# EAGLE design uhf container (EAGLE 9.0.1)
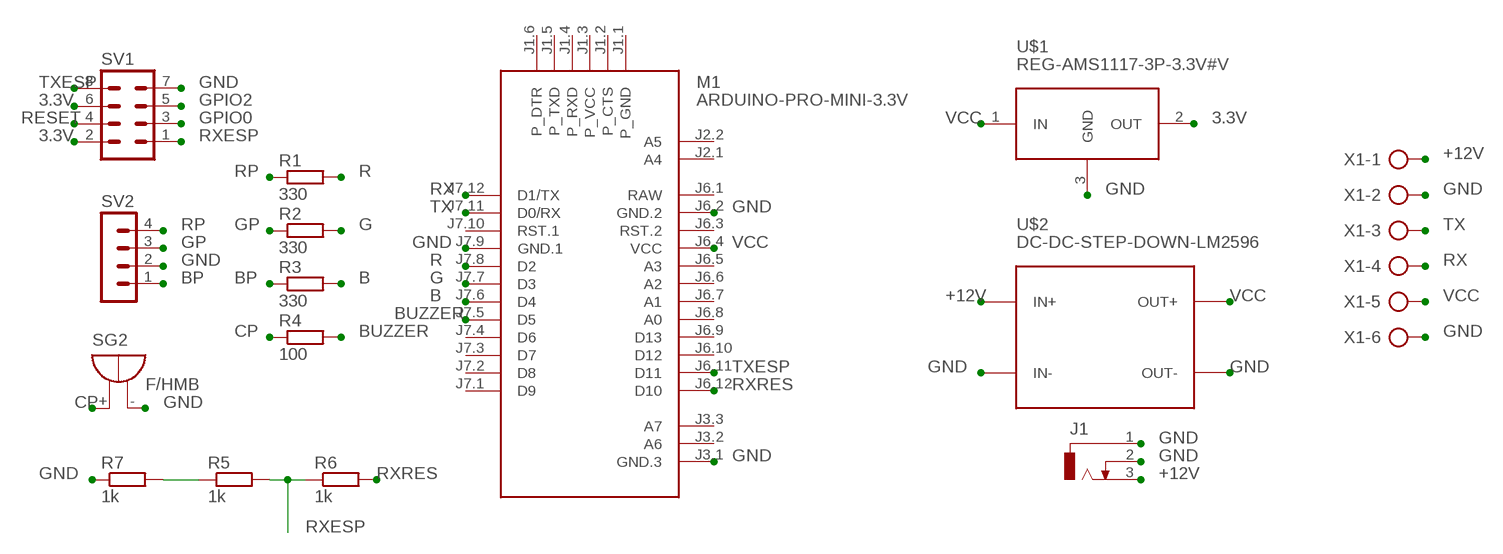
[diagram p0: schematic, sheet 1]

## Parts
J1  DCJ0303  [DCJ0303]
M1  ARDUINO-PRO-MINI-3.3V  [ARDUINO-PRO-MINI]
R1  330  R-EU_0207/7  [0207/7]
R2  330  R-EU_0207/7  [0207/7]
R3  330  R-EU_0207/7  [0207/7]
R4  100  R-EU_0207/7  [0207/7]
R5  1k  R-EU_0207/7  [0207/7]
R6  1k  R-EU_0207/7  [0207/7]
R7  1k  R-EU_0207/7  [0207/7]
SG2  F/HMB  [F/HMB]
SV1  MA04-2  [MA04-2]
SV2  MA04-1  [MA04-1]
U$1  REG-AMS1117-3P-3.3V#V  [REG-AMS1117-3P#V]
U$2  DC-DC-STEP-DOWN-LM2596  [DC-DC-STEP-DOWN-LM2596]
X1  AK300/6  [AK300/6]

## Nets
3.3V: SV1.2 SV1.6 U$1.2(OUT)
+12V: J1.3 U$2.IN+ X1.1
B: M1.J7.6(D4) R3.2
BP: R3.1 SV2.1
BUZZER: M1.J7.5(D5) R4.2
CP: R4.1 SG2.+
G: M1.J7.7(D3) R2.2
GND: J1.1 J1.2 M1.J3.1(GND.3) M1.J6.2(GND.2) M1.J7.9(GND.1) R7.1 SG2.- SV1.7 SV2.2 U$1.3(GND) U$2.IN- U$2.OUT- X1.2 X1.6
GP: R2.1 SV2.3
GPIO0: SV1.3
GPIO2: SV1.5
N$1: R5.1 R7.2
R: M1.J7.8(D2) R1.2
RESET: SV1.4
RP: R1.1 SV2.4
RX: M1.J7.12(D1/TX) X1.4
RXESP: R5.2 R6.1 SV1.1
RXRES: M1.J6.12(D10) R6.2
TX: M1.J7.11(D0/RX) X1.3
TXESP: M1.J6.11(D11) SV1.8
VCC: M1.J6.4(VCC) U$1.1(IN) U$2.OUT+ X1.5
Unconnected: M1.J1.1(P_GND) M1.J1.2(P_CTS) M1.J1.3(P_VCC) M1.J1.4(P_RXD) M1.J1.5(P_TXD) M1.J1.6(P_DTR) M1.J2.1(A4) M1.J2.2(A5) M1.J3.2(A6) M1.J3.3(A7) M1.J6.3(RST.2) M1.J6.5(A3) M1.J6.6(A2) M1.J6.7(A1) M1.J6.8(A0) M1.J6.9(D13) M1.J6.10(D12) M1.J7.1(D9) M1.J7.2(D8) M1.J7.3(D7) M1.J7.4(D6) M1.J7.10(RST.1)

## Power pins joined to a net without a drawn wire
RAW: M1.J6.1(RAW)

## Library data of the parts
J1 = con-jack:DCJ0303: DC POWER JACK Source: DCJ0303.pdf; OC_FARNELL: unknown; OC_NEWARK: unknown
M1 = diy-modules:ARDUINO-PRO-MINI-*: Arduino Pro Mini and compatible devices More details available here: https://www.arduino.cc/en/Main/ArduinoBoardProMini Click here to find device on ebay.com <http://www.ebay.com/sch/arduino+pro+mini>
R1-R7 = resistor:R-EU_: RESISTOR, European symbol
SG2 = buzzer:F/HMB: BUZZER Source: Buerklin; OC_FARNELL: unknown; OC_NEWARK: unknown
SV1 = con-lstb:MA04-2: PIN HEADER; OC_FARNELL: unknown; OC_NEWARK: unknown
SV2 = con-lstb:MA04-1: PIN HEADER; OC_FARNELL: unknown; OC_NEWARK: unknown
U$1 = diy-modules:REG-AMS1117-3P-*: Linear Regulator based on AMS1117 chip 3-pin version AMS1117 datasheet is available here: http://www.advanced-monolithic.com/pdf/ds1117.pdf Click here to find device on ebay.com <http://www.ebay.com/sch/ams1117+module> Note: There are many variants. Search for the proper version.
U$2 = diy-modules:DC-DC-STEP-DOWN-LM2596: DC/DC Step-Down Regulator based on LM2596-ADJ chip LM2596 datasheet available here: http://www.ti.com/lit/ds/symlink/lm2596.pdf Click here to find device on ebay.com <http://www.ebay.com/sch/lm2596+power+regulator>
X1 = con-ptr500:AK300/6: CONNECTOR; OC_FARNELL: unknown; OC_NEWARK: unknown

## Board
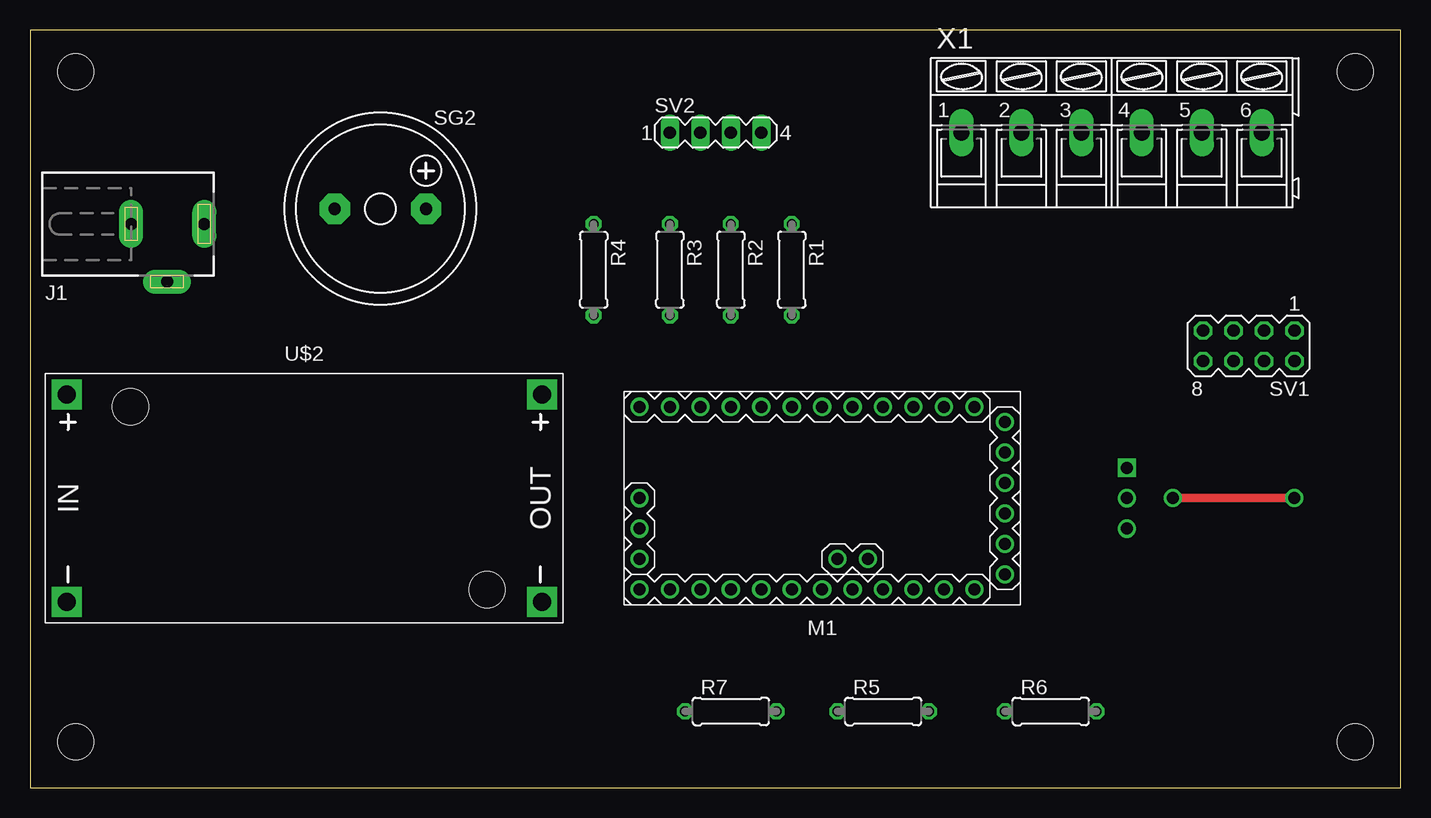
[diagram p1: board, top side]
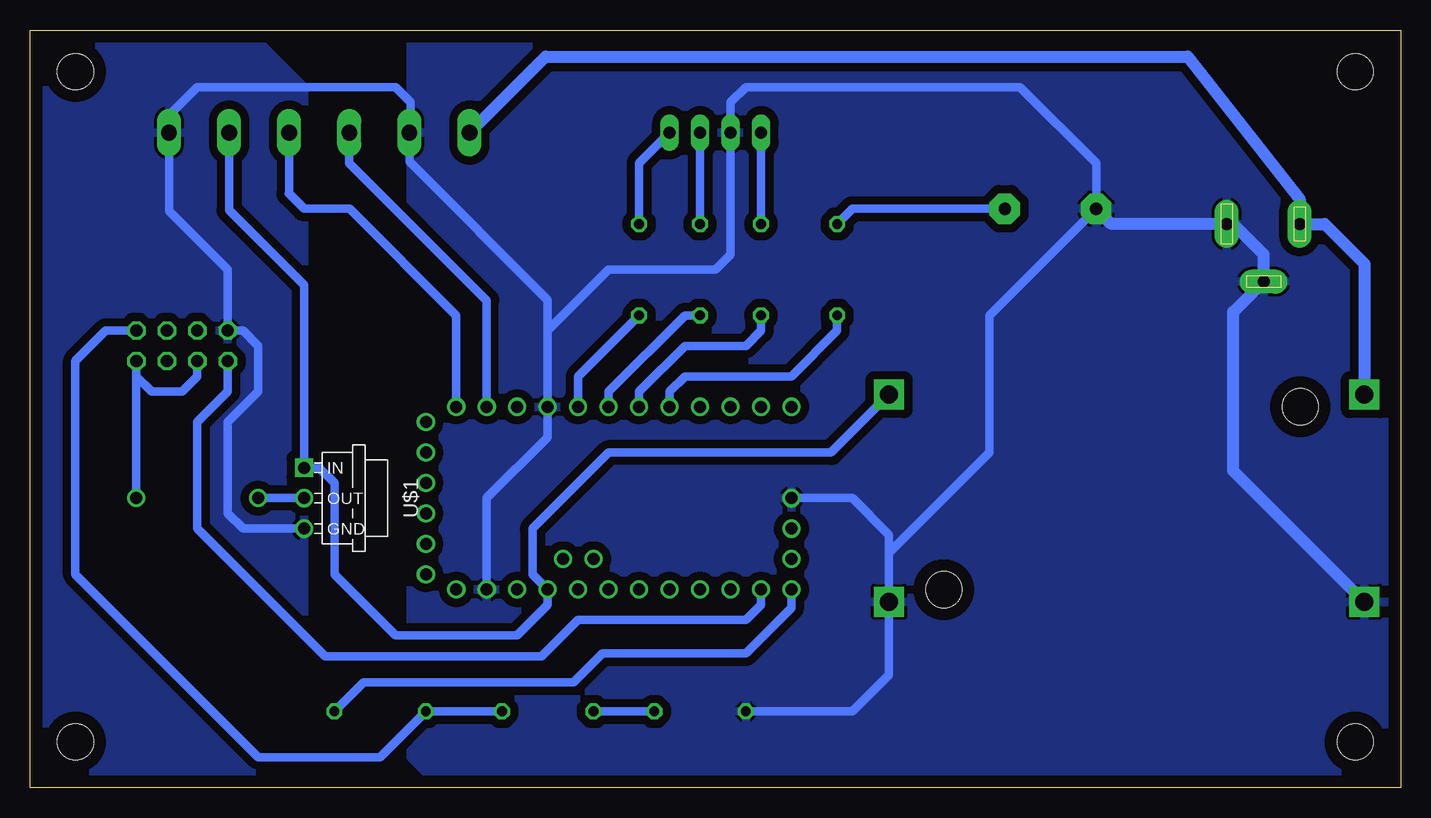
[diagram p2: board, bottom side, seen from below]

Size 114.28 x 63.17 mm. Coordinates in mm from the lower left corner, seen from the top.
Outline: 0,0 114.28,0 114.28,63.17 0,63.17 0,0
Copper layers (1*16): Top 0.035mm / dielectric 1.5mm / Bottom 0.035mm
Design rules "default *": minimum track width 6mil, minimum drill 0.35mm, track to track 0.7mm, track to pad 0.7mm, pad to pad 0.7mm, via to via 0.7mm, smd to smd 0.7mm, copper to edge 40mil, drill to drill 6mil, minimum pad ring 10mil, minimum via ring 8mil, stop-mask expansion 4mil, vias tented up to drill 0mil, thermal gap 10mil
Holes 3 mm at 3.81,59.69 3.81,3.81 110.49,3.81 110.49,59.69

### Footprints (pad centres in the part's own frame; a part is rotated, then mirrored left to right if it is on the bottom)
DCJ0303 = drill 1 pad 2 long: 1 0,3.1; 2 4.8,0; 3 0,-3
ARDUINO-PRO-MINI = drill 1: J1.1 -15.24,6.35; J1.2 -15.24,3.81; J1.3 -15.24,1.27; J1.4 -15.24,-1.27; J1.5 -15.24,-3.81; J1.6 -15.24,-6.35; J2.1 -1.27,5.08; J2.2 -3.81,5.08; J3.1 15.24,0; J3.2 15.24,2.54; J3.3 15.24,5.08; J6.1 -12.7,7.62; J6.2 -10.16,7.62; J6.3 -7.62,7.62; J6.4 -5.08,7.62; J6.5 -2.54,7.62; J6.6 0,7.62; J6.7 2.54,7.62; J6.8 5.08,7.62; J6.9 7.62,7.62; J6.10 10.16,7.62; J6.11 12.7,7.62; J6.12 15.24,7.62; J7.1 15.24,-7.62; J7.2 12.7,-7.62; J7.3 10.16,-7.62; J7.4 7.62,-7.62; J7.5 5.08,-7.62; J7.6 2.54,-7.62; J7.7 0,-7.62; J7.8 -2.54,-7.62; J7.9 -5.08,-7.62; J7.10 -7.62,-7.62; J7.11 -10.16,-7.62; J7.12 -12.7,-7.62
0207/7 = drill 0.813 octagon: 1 -3.81,0; 2 3.81,0
F/HMB = drill 1.016 pad 2.54 octagon: + 3.81,0; - -3.81,0
MA04-2 = drill 1.016 octagon: 1 -3.81,-1.27; 2 -3.81,1.27; 3 -1.27,-1.27; 4 -1.27,1.27; 5 1.27,-1.27; 6 1.27,1.27; 7 3.81,-1.27; 8 3.81,1.27
MA04-1 = drill 1.016 long: 1 -3.81,0; 2 -1.27,0; 3 1.27,0; 4 3.81,0
REG-AMS1117-3P#V = drill 1 square: 1 -2.54,-5.08 | drill 1: 2 0,-5.08; 3 2.54,-5.08
DC-DC-STEP-DOWN-LM2596 = drill 1.5 pad 2.5 square: IN+ -19.812,8.636; IN- -19.812,-8.636; OUT+ 19.812,8.636; OUT- 19.812,-8.636 | hole 3: -14.478,7.62; 15.24,-7.62
AK300/6 = drill 1.321 long: 1 -12.522,0; 2 -7.518,0; 3 -2.515,0; 4 2.515,0; 5 7.518,0; 6 12.522,0

### Placement (x,y rotation side)
J1  11.43,46.99 270 top
M1  66.04,24.13 180 top
R1  63.5,43.18 270 top
R2  58.42,43.18 270 top
R3  53.34,43.18 270 top
R4  46.99,43.18 270 top
R5  71.12,6.35 0 top
R6  85.09,6.35 0 top
R7  58.42,6.35 0 top
SG2  29.21,48.26 0 top
SV1  101.6,36.83 180 top
SV2  57.15,54.61 0 top
U$1  86.36,24.13 270 bottom
U$2  22.86,24.13 0 top
X1  90.17,54.61 0 top

### Tracks (layer width: path | path; a pad name or v marks a point on that pad's centre or on a via)
3.3V  (via drill 1)
  Top 0.7: v95.25,24.13 v105.41,24.13
  Bottom 0.7: SV1.6 100.33,34.29 101.6,33.02 104.14,33.02 105.41,34.29 SV1.2 v105.41,24.13 | U$1.2 v95.25,24.13
+12V
  Bottom 1: U$2.IN+ 3.05,43.69 6.35,46.99 J1.3 8.43,49.07 17.78,60.96 71.3,60.96 X1.1
B
  Bottom 0.7: M1.J7.6 63.5,33.02 59.69,36.83 54.61,36.83 53.34,38.1 R3.2
BP
  Bottom 0.7: SV2.1 R3.1
BUZZER
  Bottom 0.7: M1.J7.5 60.96,33.02 59.69,34.29 50.8,34.29 46.99,38.1 R4.2
CP
  Bottom 0.7: R4.1 45.72,48.26 SG2.+
G
  Bottom 0.7: M1.J7.7 66.04,33.02 59.69,39.37 R2.2
GND
  Bottom 0.7: 71.12,38.1 66.04,43.18 57.15,43.18 55.88,44.45 SV2.2 55.88,57.15 54.61,58.42 31.75,58.42 25.4,52.07 SG2.- 34.29,39.37 34.29,27.94 42.67,19.56 | 71.12,38.1 M1.J7.9 71.12,29.21 76.2,24.13 M1.J6.2 | R7.1 45.72,6.35 42.67,9.4 U$2.OUT- 42.67,19.56 | 71.12,38.1 71.12,40.64 82.65,52.17 X1.2 82.55,54.71 82.55,57.15 83.82,58.42 100.33,58.42 102.69,56.06 X1.6 102.69,48.08 97.79,43.18 SV1.7 96.52,38.1 95.25,36.83 95.25,33.02 97.79,30.48 97.79,22.86 96.52,21.59 U$1.3 | M1.J3.1 45.72,24.13 42.67,21.08 42.67,19.56
  Bottom 1: U$2.IN- 13.97,26.42 13.97,39.65 J1.2 11.43,44.45 13.97,46.99 J1.1 24.13,46.99 SG2.-
  pour Bottom: 0,62.23 0,1.27 1.27,0 80.01,0 82.55,2.54 82.55,27.94 82.55,62.23 81.79,62.99 81.41,62.99 0.76,62.99
  pour Bottom: 95.25,0 113.03,0 114.3,1.27 114.3,60.96 113.03,62.23 95.25,62.23 91.44,58.42 91.44,3.81
GP
  Bottom 0.7: SV2.3 R2.1
N$1
  Bottom 0.7: R5.1 R7.2
R
  Bottom 0.7: R1.2 68.58,34.29 M1.J7.8
RP
  Bottom 0.7: SV2.4 63.5,52.07 R1.1
RX
  Bottom 0.7: X1.4 92.69,49.55 | 92.69,49.55 92.71,49.53 | M1.J7.12 78.74,39.37 87.63,48.26 91.44,48.26 92.69,49.5 92.69,49.55
RXESP
  Bottom 0.7: R5.2 R6.1 85.09,2.54 95.25,2.54 110.49,17.78 110.49,35.56 107.95,38.1 SV1.1
RXRES
  Bottom 0.7: R6.2 86.49,8.76 68.96,8.76 66.55,11.18 54.61,11.18 50.8,14.99 M1.J6.12
TX
  Bottom 0.7: M1.J7.11 76.2,40.61 87.66,52.07 X1.3
TXESP
  Bottom 0.7: M1.J6.11 53.34,15.24 54.61,13.97 68.58,13.97 71.63,10.92 89.66,10.92 100.33,21.59 100.33,30.48 97.79,33.02 SV1.8
VCC
  Bottom 0.7: U$2.OUT+ 47.5,27.94 66.04,27.94 72.39,21.59 72.39,17.78 M1.J6.4 71.12,15.24 73.66,12.7 83.82,12.7 88.9,17.78 88.9,25.4 90.17,26.67 U$1.1 91.44,41.91 97.69,48.16 X1.5